# Altium project DigitalInterface_FM.PrjPcb
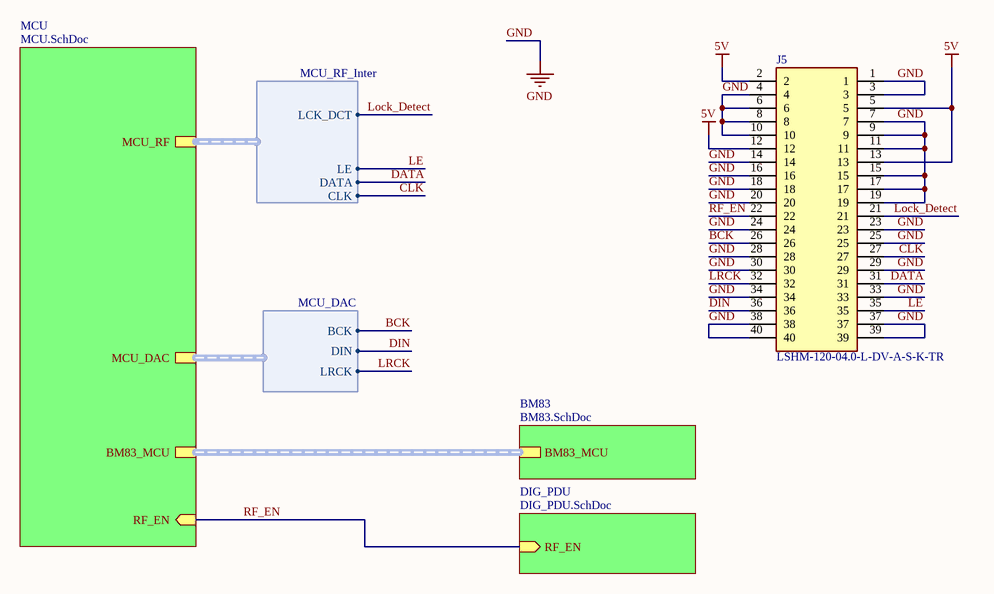
[diagram p0: ConnectorInterface.SchDoc]
4 sheets, 43 parts. Net scope: hierarchical (ports join the sheet entries above them; power ports are global).
Board file: DI_FM.PcbDoc
Sheets:
  ConnectorInterface.SchDoc
    DIG_PDU = DIG_PDU.SchDoc
    MCU = MCU.SchDoc
    BM83 = BM83.SchDoc

## Sheet ConnectorInterface.SchDoc
size 215 x 279 mm; SheetNumber: 1; SheetTotal: 4

### Parts
J5  LSHM-120-04.0-L-DV-A-S-K-TR  [LSHM-120-XX.X-YYY-DV-A-S-K-TR]

### Sub-sheets
BM83 = BM83.SchDoc: BM83_MCU (harness BM83_MCU)
DIG_PDU = DIG_PDU.SchDoc: RF_EN (in)
MCU = MCU.SchDoc: BM83_MCU (harness BM83_MCU), MCU_RF (harness MCU_RF_Inter), MCU_DAC (harness MCU_DAC), RF_EN (in)

### Harnesses
MCU_RF_Inter: LCK_DCT, LE, DATA, CLK
MCU_DAC: BCK, DIN, LRCK

### Nets
5V: J5.2 J5.5 J5.12 J5.13
GND: J5.1 J5.3 J5.4 J5.6 J5.7 J5.8 J5.9 J5.10 J5.11 J5.14 J5.15 J5.16 J5.17 J5.18 J5.19 J5.20 J5.23 J5.24 J5.25 J5.28 J5.29 J5.30 J5.33 J5.34 J5.37 J5.38 J5.39 J5.40
BCK: J5.26 ; sheet MCU/MCU_DAC.BCK
CLK: J5.27 ; sheet MCU/MCU_RF.CLK
DATA: J5.31 ; sheet MCU/MCU_RF.DATA
DIN: J5.36 ; sheet MCU/MCU_DAC.DIN
LE: J5.35 ; sheet MCU/MCU_RF.LE
Lock_Detect: J5.21 ; sheet MCU/MCU_RF.LCK_DCT
LRCK: J5.32 ; sheet MCU/MCU_DAC.LRCK
RF_EN: J5.22 ; sheet DIG_PDU/RF_EN, sheet MCU/RF_EN

### Buses and harness runs
harness sheet BM83/BM83_MCU = sheet MCU/BM83_MCU

### Notes on the sheet
- Contents
- Revision Notes

### Library data of the parts
J5 = LSHM-120-04.0-L-DV-A-S-K-TR: Connector; Manufacturer_Name: SAMTEC; Datasheet Link: http://suddendocs.samtec.com/prints/lshm-1xx-xx.x-xxx-dv-a-x-x-xx-mkt.pdf; Manufacturer_Part_Number: LSHM-120-04.0-L-DV-A-S-K-TR; Mouser Part Number: 200-LSHM12004LDVASK; Mouser Price/Stock: https://www.mouser.co.uk/ProductDetail/Samtec/LSHM-120-040-L-DV-A-S-K-TR?qs=PB6%2FjmICvI1v5WBlLc04lg%3D%3D; Arrow Part Number: LSHM-120-04.0-L-DV-A-S-K-TR; Arrow Price/Stock: https://www.arrow.com/en/products/lshm-120-04.0-l-dv-a-sktr/samtec?region=nac

## Sheet DIG_PDU.SchDoc
size 279 x 215 mm; SheetNumber: 4; SheetTotal: 4
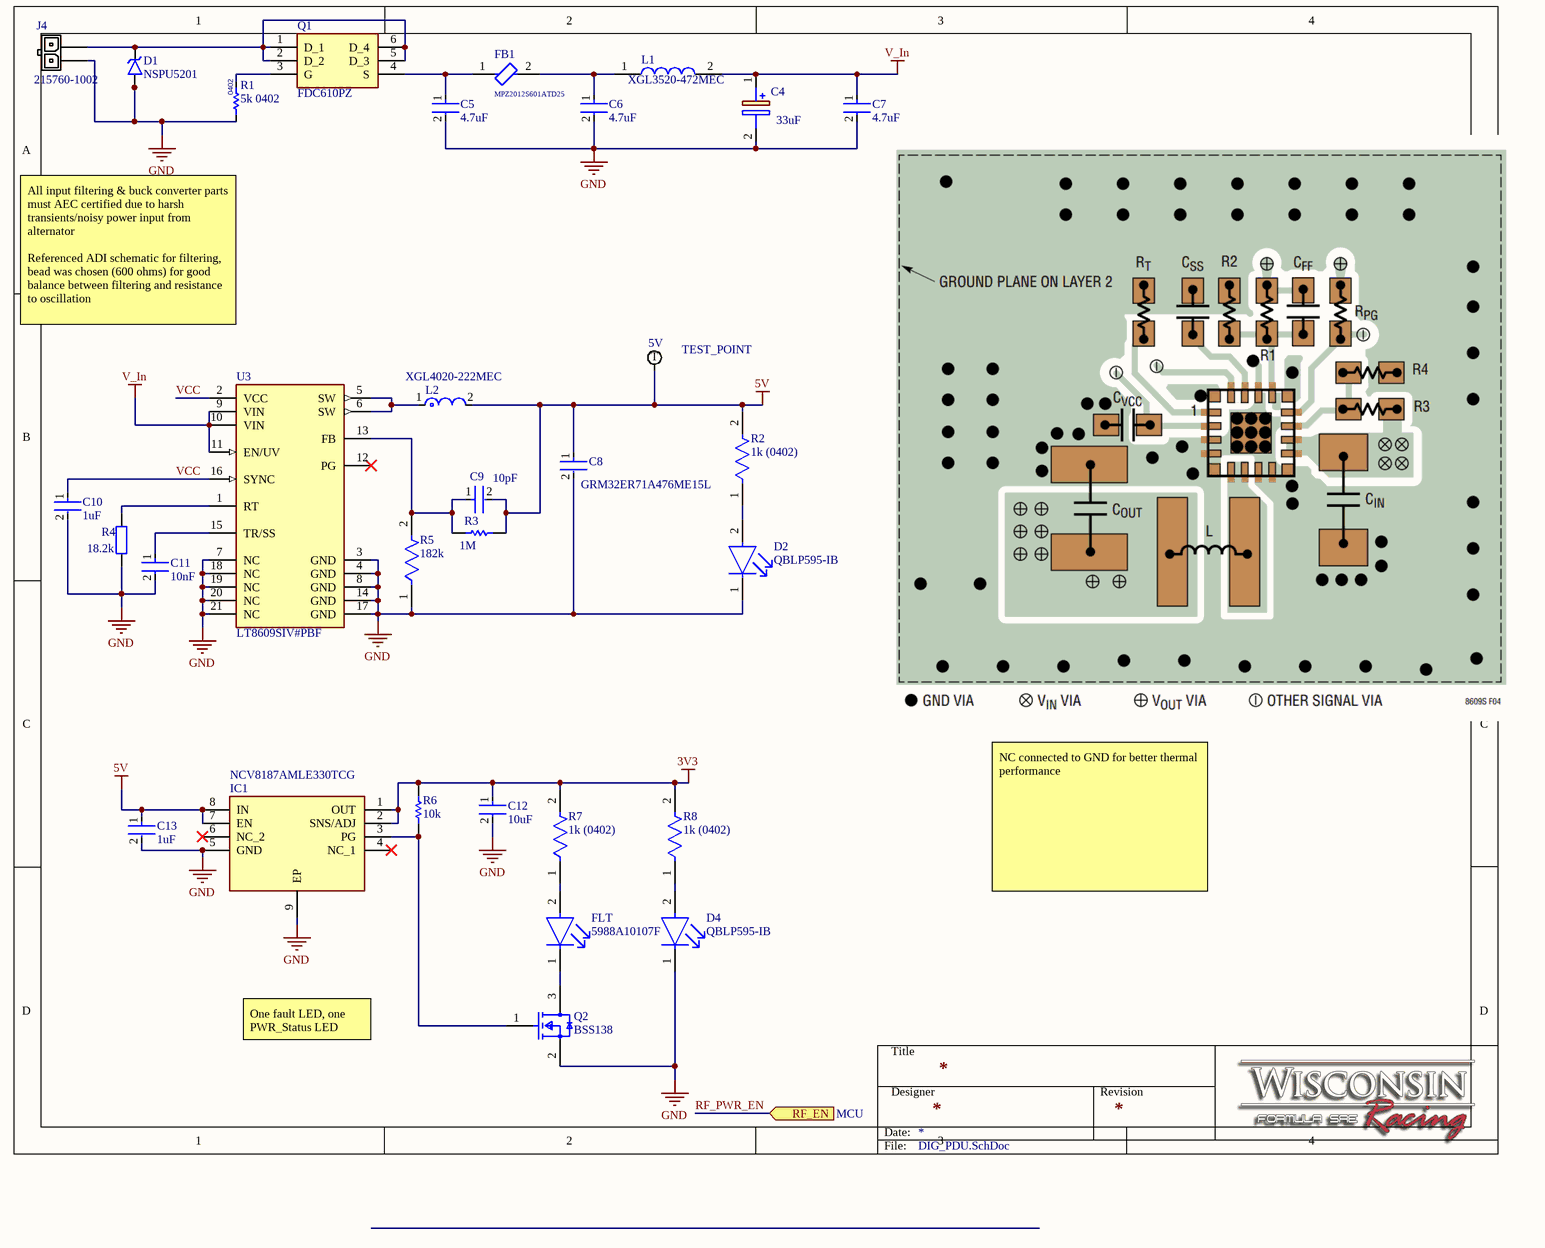
[diagram p1: DIG_PDU.SchDoc]

### Parts
5V  TEST_POINT  [TEST_POINT-Footprint-1]  (no BOM)
C4  HHXC500ARA330MF80G  [CAPAE660X800N]  (value not drawn)
C5  4.7uF  [FP-CGA4J-IPC_C]
C6  4.7uF  [FP-CGA4J-IPC_C]
C7  4.7uF  [FP-CGA4J-IPC_C]
C8  GRM32ER71A476ME15L  [FP-GRM32E-0_3-0_2-IPC_A]
C9  10pF  [FP-GCM155-0_05-IPC_C]
C10  1uF  [FP-GRT155-0_1-IPC_A]
C11  10nF  [FP-GCM155-0_05-IPC_C]
C12  10uF  [FP-GRM155-0_2-IPC_A]
C13  1uF  [FP-GRM155-0_1-IPC_C]
D1  NSPU5201  [NSPM5131MUTBG]
D2  QBLP595-IB  [FP-QBLP595-IB-MFG]
D4  QBLP595-IB  [FP-QBLP595-IB-MFG]
FB1  MPZ2012S601ATD25  [BEADC2012X105N]
FLT  5988A10107F  [FP-5988A10107F-MFG]
IC1  NCV8187AMLE330TCG  [SON65P300X300X100-9N-D]
J4  215760-1002  [215760-1002-Footprint-1]
L1  XGL3520-472MEC  [XGL3520472MEC]
L2  XGL4020-222MEC  [FP-XGL4020-MFG]
Q1  FDC610PZ  [SOT95P280X110-6N]
Q2  BSS138  [FP-318-08-IPC_B]
R1  5k 0402  [Res0402-Type-1]
R2  1k (0402)  [FP-RC0402-0_4-IPC_A]
R3  1M  [RESC1005X40X25NL05T10]
R4  18.2k  [WRIS-RSKS_0402]
R5  182k  [FP-AC0402-IPC_C]
R6  10k  [RESC1005X40X25ML05T05]
R7  1k (0402)  [FP-RC0402-0_4-IPC_A]
R8  1k (0402)  [FP-RC0402-0_4-IPC_A]
U3  LT8609SIV#PBF  [FP-LQFN-16-05-08-1516-MFG]

### Ports
RF_EN (in, see MCU)

### Nets
3V3: C12.1 IC1.1(OUT) IC1.2(SNS/ADJ) R6.2 R7.2 R8.2
5V: 5V.1 C8.1 C9.2 C13.1 IC1.7(EN) IC1.8(IN) L2.2 R2.2 R3.2
GND: C4.2(-) C5.2 C6.2 C7.2 C8.2 C10.2 C11.2 C12.2 C13.2 D1.5(GND_(A)_1) D1.6(GND_(A)_2) D1.7(GND_(A)_3) D1.8(GND_(A)_4) D2.1(C) D4.1(C) IC1.5(GND) IC1.9(EP) J4.2 Q2.2(S) R1.1 R4.1 R5.1 U3.3(GND) U3.4(GND) U3.7(NC) U3.8(GND) U3.14(GND) U3.17(GND) U3.18(NC) U3.19(NC) U3.20(NC) U3.21(NC)
V_In: C4.1(+) C7.1 L1.2 U3.9(VIN) U3.10(VIN) U3.11(EN/UV)
VCC: C10.1 U3.2(VCC) U3.16(SYNC)
NetC5_1: C5.1 FB1.1 Q1.4(S)
NetC6_1: C6.1 FB1.2 L1.1
NetC9_1: C9.1 R3.1 R5.2 U3.13(FB)
NetC11_1: C11.1 U3.15(TR/SS)
NetD1_1: D1.1 D1.2 J4.1 Q1.1(D_1) Q1.2(D_2) Q1.5(D_3) Q1.6(D_4)
NetD2_2: D2.2(A) R2.1
NetD4_2: D4.2(A) R8.1
NetFLT_1: FLT.1(C) Q2.3(D)
NetFLT_2: FLT.2(A) R7.1
NetIC1_3: IC1.3(PG) Q2.1(G) R6.1
NetL2_1: L2.1 U3.5(SW) U3.6(SW)
NetQ1_3: Q1.3(G) R1.2
NetR4_2: R4.2 U3.1(RT)

Not connected (* = marked no-connect by the designer): IC1 4(NC_1)* 6(NC_2)*; U3 12(PG)*

### Notes on the sheet
- (near C4) 33uF
- All input filtering & buck converter parts must AEC certified due to harsh transients/noisy power input from alternator
  Referenced ADI schematic for filtering, bead was chosen (600 ohms) for good balance between filtering and resistance to oscillation
- NC connected to GND for better thermal performance
- One fault LED, one PWR_Status LED
- Title
- Designer
- Revision
- Date:
- File:
- (in symbol CMP-00005-4) T
- (in symbol CMP-Res-00031-1) 0402

### Library data of the parts
5V = CMP-00005-4: Pad for testing
C4 = HHXC500ARA330MF80G: Capacitor Polarised; Manufacturer_Name: Chemi-Con; Datasheet Link: https://www.digikey.com/en/products/detail/chemi-con/HHXC500ARA330MF80G/6928175; Height: 8mm; Manufacturer_Part_Number: HHXC500ARA330MF80G; Mouser Part Number: 661-HHXC500A330MF80G; Mouser Price/Stock: https://www.mouser.co.uk/ProductDetail/Chemi-Con/HHXC500ARA330MF80G?qs=u4fy%2FsgLU9MsXjhGLyQcVQ%3D%3D; Arrow Part Number: HHXC500ARA330MF80G; Arrow Price/Stock: null?utm_currency=USD&region=nac
C5-C7 = CMP-08246-000171-1: Cap Ceramic 4.7uF 50V X7R 10% Pad SMD 0805 +125°C Automotive T/R
C8 = CMP-2000-06363-3: Chip Multilayer Ceramic Capacitors for General Purpose, 1210, 47uF, X7R, 15%, 20%, 10V; Voltage Rating (DC): 10V; Lead Free: Lead Free; Capacitance: 47uF; Max Operating Temperature: 125°C; Height: 2.5mm; Min Operating Temperature: -55°C; Length: 3.2mm; Package Quantity: 1; Termination: SMD/SMT; Case Code (Imperial): 1210; Width: 0.098inch; Voltage Rating: 10V; Thickness: 0.106inch; Depth: 2.5mm; REACH SVHC: No SVHC; Packaging: Tape and Reel; Dielectric: X7R; Voltage: 10V; Radiation Hardening: No; Case Code (Metric): 3225; Tolerance: 20%; Case/Package: 1210; Mount: Surface Mount
C9 = CMP-06035-039712-1: Ceramic Capacitor for Automotive 10pF ±5% 50VDC C0G 0402 Paper T/R; Voltage Rating: 50V; Case/Package: 0402; Dielectric: C0G; Package Quantity: 10000; Ratings: AEC-Q200; Max Operating Temperature: 125°C; Width: 0.02inch; REACH SVHC: No SVHC; Mount: Surface Mount; Min Operating Temperature: -55°C; Lead Free: Lead Free; Packaging: Tape and Reel; Capacitance: 10pF; Case Code (Imperial): 0402; Tolerance: 5%; Height: 0.5mm; Thickness: 0.022inch; Length: 0.039inch; Case Code (Metric): 1005; Weight: 0.000212oz; Voltage Rating (DC): 50V; Termination: SMD/SMT
C10 = CMP-06035-047663-1: Multi-Layer Ceramic Capacitor 1uF 25V X6S ±10% 0402 Paper T/R / GRT155C81E105KE13D
C11 = CMP-2008-03723-3: Ceramic Capacitor for Automotive 10nF ±10% 50VDC X7R 0402 Paper T/R / GCM155R71H103KA55D; Voltage Rating (DC): 50V; Min Operating Temperature: -55°C; Radiation Hardening: No; Mount: Surface Mount; Thickness: 0.022inch; Package Quantity: 1; Case Code (Imperial): 0402; Lead Free: Lead Free; Case/Package: 0402; Depth: 0.5mm; Termination: SMD/SMT; Tolerance: 10%; Voltage: 50V; Packaging: Tape and Reel; Width: 0.02inch; REACH SVHC: No SVHC; Height: 0.5mm; Max Operating Temperature: 125°C; Case Code (Metric): 1005; Voltage Rating: 50V; Capacitance: 10nF; Ratings: AEC-Q200; Length: 1mm; Dielectric: X7R
C12 = CMP-06035-061139-1: Chip Multilayer Ceramic Capacitors for General Purpose, 0402, 10uF, X5R, 15%, 20%, 6.3V
C13 = CMP-06035-028020-1: Chip Multilayer Ceramic Capacitors for General Purpose, 0402, 1.0uF, X7R, 15%, 10%, 10V / GRM155Z71A105KE01D
D1 = CMP-004-000061-2: Unidirectional High Voltage ESD and Surge Protection; Provides ESD Protection to IEC6100042 Level 4: +/-30 kV Contact Discharge; Small Package: 1.8 mm x 2.0 mm; These Devices are PbFree; Manufacturer_Name: onsemi; Arrow Part Number: NSPU5201MUTBG; Design Item ID: NSPU5201MUTBG; Source: SamacSys.SchLib; Mouser Price/Stock: https://www.mouser.co.uk/ProductDetail/ON-Semiconductor/NSPU5201MUTBG?qs=byeeYqUIh0OtIrNH4%2Fsnzg%3D%3D; Mouser Part Number: 863-NSPU5201MUTBG; Height: 0mm; Datasheet Link: https://www.onsemi.com/pub/Collateral/NSPU5201-D.PDF; Manufacturer_Part_Number: NSPU5201MUTBG; Arrow Price/Stock: https://www.arrow.com/en/products/nspu5201mutbg/on-semiconductor
D2 D4 = CMP-113271-000002-1: LED BLUE CLEAR 0402 SMD; Lens Size: 0.5mm; Dominant Wavelength: 465nm; Forward Voltage: 3.1V; Lens Color: Colorless; Luminous Intensity: 85mcd; Test Current: 20mA; Viewing Angle: 140°; Lens Style: Flat; Width: 0.5mm; Case Code (Metric): 1005; Lens Transparency: Clear; Color: Blue; Packaging: Tape and Reel; Case Code (Imperial): 0402; Mount: Surface Mount; Length: 1mm; Case/Package: 0402; Height: 0.6mm
FB1 = CMP-002-000016-2: Ferrite Beads Multi-Layer Power 600Ohm 25% 100MHz 2A 100mOhm DCR 0805 Automotive T/R; Manufacturer_Name: TDK; Arrow Part Number: MPZ2012S601ATD25; Datasheet Link: https://product.tdk.com/system/files/dam/doc/product/emc/emc/beads/catalog/beads_automotive_power_mpz2012_en.pdf; Manufacturer_Part_Number: MPZ2012S601ATD25; Design Item ID: MPZ2012S601ATD25; Height: 1.05mm; Mouser Price/Stock: https://www.mouser.co.uk/ProductDetail/TDK/MPZ2012S601ATD25?qs=n0%2F4YYxsltT7vo9AjVUU7w%3D%3D; Mouser Part Number: 810-MPZ2012S601ATD25; Source: SamacSys.SchLib; Arrow Price/Stock: https://www.arrow.com/en/products/mpz2012s601atd25/tdk.html?utm_currency=USD&region=europe
FLT = CMP-00106-100993512-1: 5988A10107F LED Uni-Color Red 2-Pin Chip 0402(1006Metric) T/R; Forward Voltage: 1.6V; Forward Current: 5mA; Power Dissipation: 46mW; Reverse Voltage: 5V; Luminous Intensity: 65mcd; Viewing Angle: 140°; Wavelength: 635nm; Max Operating Temperature: 85°C; Case/Package: 0402; Color: Red; Height: 533.4µm; NexarPartId: 100993512; RoHS: Compliant; Schedule B: 8541402000, 8541402000; Min Operating Temperature: -40°C
IC1 = NCV8187AMLE330TCG: Integrated Circuit; Manufacturer_Name: onsemi; Datasheet Link: https://www.onsemi.com/pub/Collateral/NCV8187-D.PDF; Height: 1mm; Manufacturer_Part_Number: NCV8187AMLE330TCG; Mouser Part Number: 863-CV8187AMLE330TCG; Mouser Price/Stock: https://www.mouser.co.uk/ProductDetail/onsemi/NCV8187AMLE330TCG?qs=HBWAp0VN4RhK8HbhfCLXcQ%3D%3D; Arrow Part Number: NCV8187AMLE330TCG; Arrow Price/Stock: https://www.arrow.com/en/products/ncv8187amle330tcg/on-semiconductor?region=nac
J4 = CMP-007-000050-6: Micro-Fit+ Right-Angle Header, 3.00mm Pitch, Single Row, 2 Circuits, Matte Tin (Sn) Plating, UL 94V-0, Glow-Wire Capable, Black; Manufacturer 1: Molex; Number of Contacts: 2; Manufacturer Part Number 1: 215760-1002; Number of Rows: 1
L1 = XGL3520-472MEC: Inductor; Manufacturer_Name: COILCRAFT; Datasheet Link: https://www.coilcraft.com/getmedia/d18b8771-c466-42ab-98b9-5b7a3721ea57/xgl3520.pdf?srsltid=AfmBOoq9-uDh3EmdFKVY7cd9_AL22AmMmwAAQ9UBadXdflM2b3sgRKIR; Height: 2mm; Manufacturer_Part_Number: XGL3520-472MEC
L2 = CMP-11268-000045-2: Shielded Power Inductors
Q1 = FDC610PZ: MOSFET (P-Channel); Manufacturer_Name: onsemi; Datasheet Link: https://www.onsemi.com/pub/Collateral/FDC610PZ-D.PDF; Height: 1.1mm; Manufacturer_Part_Number: FDC610PZ; Mouser Part Number: 512-FDC610PZ; Mouser Price/Stock: https://www.mouser.co.uk/ProductDetail/onsemi-Fairchild/FDC610PZ?qs=6olcXJbp99R1vIAdhgXLVw%3D%3D; Arrow Part Number: FDC610PZ; Arrow Price/Stock: https://www.arrow.com/en/products/fdc610pz/on-semiconductor
Q2 = CMP-07173-000101-1: MOSFET N-CH 50V 220MA SOT-23; Turn-Off Delay Time: 20ns; Element Configuration: Single; Rds On Max: 3.5R; Gate to Source Voltage (Vgs): 20V; Threshold Voltage: 1.3V; Number of Elements: 1; Power Dissipation: 360mW; Rise Time: 9ns; Turn-On Delay Time: 2.5ns; Input Capacitance: 27pF; On-State Resistance: 6R; Lead Free: Lead Free; Length: 2.92mm; Width: 1.3mm; Drain to Source Breakdown Voltage: 50V; Min Operating Temperature: -55°C; REACH SVHC: No SVHC; Packaging: Tape and Reel; Radiation Hardening: No; Height: 0.93mm; Drain to Source Voltage (Vdss): 50V; Current Rating: 220mA; Voltage Rating (DC): 50V; Weight: 0.03g; Continuous Drain Current (ID): 220mA; Number of Pins: 3; Nominal Vgs: 1.3V; Max Power Dissipation: 360mW; Fall Time: 9ns; Drain to Source Resistance: 3.5R; Contact Plating: Tin; Case/Package: SOT-23; Package Quantity: 1; Dual Supply Voltage: 50V; Mount: Surface Mount; Termination: SMD/SMT; Max Operating Temperature: 150°C
R1 = CMP-Res-00031-1: Fixed Resistor, Metal Glaze/thick Film, 0.0625W, 5000ohm, 50V, 1% +/-Tol, 100ppm/Cel, Surface Mount, 0402; Power: 63mW; Resistance: 5k; Tolerance: 1%
R2 R7 R8 = CMP-2002-07472-3: RES 1K OHM 1% 1/16W 0402; Max Power Dissipation: 63mW; Resistance: 1kR; Voltage Rating (DC): 50V; Temperature Coefficient: 100ppm/°C; Power Rating: 62.5mW; Technology: THICK FILM; Size Code: 0402; Series: RC; Length: 1mm; Case/Package: 0402; Features: Moisture Resistant; Termination: SMD/SMT; Case Code (Metric): 1005; Reach SVHC Compliant: Yes; Number of Terminations: 2; Tolerance: 1%; Lead Free: Lead Free; Military Standard: Not; Resistor Type: Thick Film; Max Operating Temperature: 155°C; RoHS Compliant: Yes; Construction: Rectangular; Voltage Rating: 50V; Packaging: Tape and Reel; Height: 0.32mm; Number of Pins: 2; Resistance Tolerance: 1%; Case Code (Imperial): 0402; Depth: 0.5mm; Min Operating Temperature: -55°C; Width: 0.5mm
R3 = CMP-2002-07490-1: Manufacturer: Yageo / Phycomp; Part Number: RC0402FR-071ML
R4 = CMP-03913-145532814-2: Resistor, 18K2, 0.1W, Thick Film, 0402 Rohs Compliant: Yes; Manufacturer Lifecycle Status: ACTIVE; YEOL: 1 = Estimated lifetime > 10 years; Resistance: 18.2kΩ; Min Operating Temperature: -55°C; Height: 350µm; RoHS: Compliant; Lifecycle Status: Production; Width: 500µm; Length: 1mm; Max Operating Temperature: 155°C
R5 = CMP-03412-035751-2: RES 182kΩ ±1% 0.063W 0402; Max Power Dissipation: 63mW; Resistance: 182kR; Power Rating: 62.5mW; Temperature Coefficient: 100ppm/°C; Voltage Rating: 50V; Number of Terminations: 2; Tolerance: 1%; Case/Package: 0402; Min Operating Temperature: -55°C; Length: 0.039inch; Packaging: Tape and Reel; Case Code (Metric): 1005; Termination: SMD/SMT; Width: 0.5mm; RoHS Compliant: Yes; Resistor Type: Thick Film; Height: 0.015inch; Max Operating Temperature: 155°C; Series: AC; Case Code (Imperial): 0402; Weight: 2.3E-05oz; Features: Moisture Resistant
R6 = CMP-2002-00433-1: Part Number: ERJ-2GEJ103X; Manufacturer: Panasonic
U3 = CMP-09139-000009-1: IC REG BUCK ADJUSTABLE 2A 16LQFN; Manufacturer: Analog Devices; Standoff Height: 0.01mm; Nominal Supply Current: 1-1.7uA; Min Supply Voltage: 3V; Max Duty Cycle: 100%; Output Type: AdjustableProgrammable; Max Junction Temp: +125°C; Switching Frequency: 200-2200kHz; Max Supply Voltage: 42V; Number Of Outputs: 1; Digikey Description: IC REG BUCK ADJUSTABLE 2A 16LQFN; Octopart: https://octopart.com/lt8609siv%23pbf-analog+devices-88316701; Automotive: No; Package: LQFN-16-05-08-1516; Temperature Range High: +125°C; Category: IC; Temperature Range Low: -40°C; ComponentLink2Description: Datasheet; Output Current: 2A; Mouser Description: LT8609S - 42V, 2A/3A Peak Synchronous Step-Down Regulator with 2.5µA Quiescent Current; Temperature: -40°C to +125°C; ComponentLink2URL: https://www.analog.com/media/en/technical-documentation/data-sheets/LT8609S.pdf; RoHS: TRUE; Device Class L2: Power Management ICs; Device Class L3: Voltage Regulators - Switching; Height: 1.03mm; Device Class L1: Integrated Circuits (ICs); Switching Topology: Buck; Lead Free: Yes; Manufacturer Part Number: LT8609SIV#PBF

## Sheet MCU.SchDoc
size 279 x 215 mm; SheetNumber: 3; SheetTotal: 4; SPICEModelCacheLZXJEGGY: <root> / <DocumentId>LZXJEGGY</DocumentId> / <CacheFrame Number="0"> / <Model Name="cap" Kind="MDL"> / <Text>*Default semiconductor capacitor / .MODEL CAP C()</Text> / </Model> / </CacheFrame> / </root>
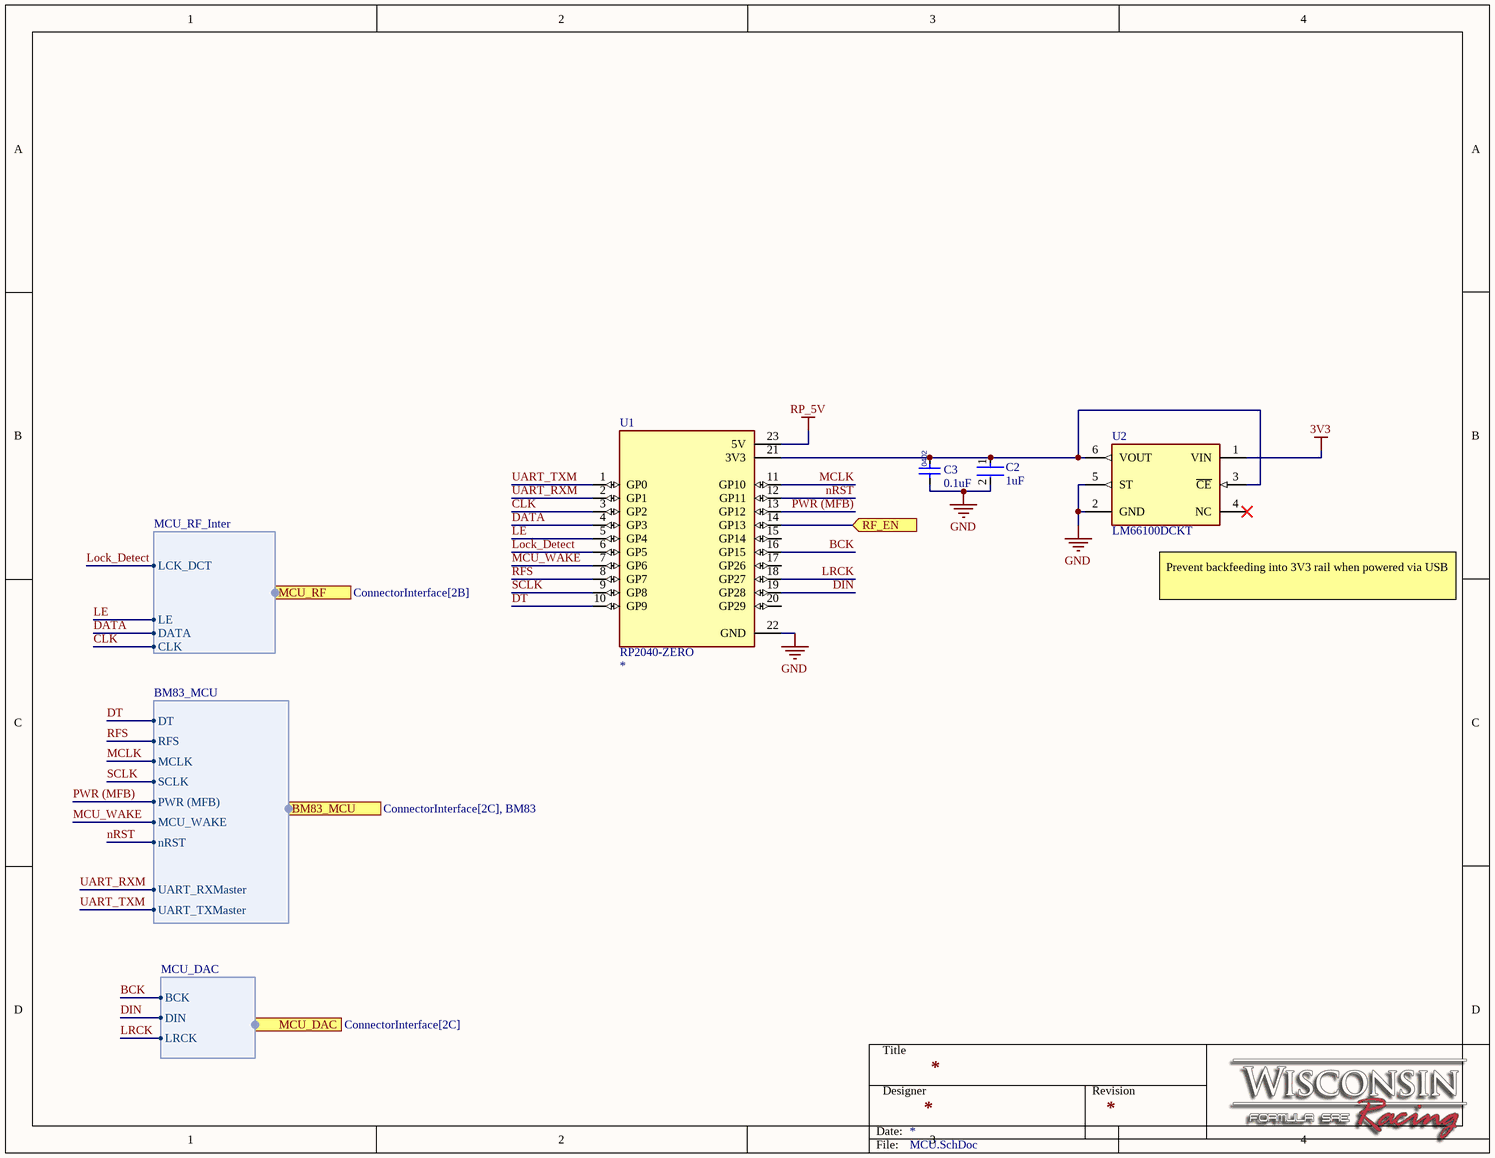
[diagram p2: MCU.SchDoc]

### Parts
C2  1uF  [FP-GRM155-0_1-IPC_C]
C3  0.1uF  [FP-CC0402-IPC_B]
U1  RP2040-ZERO  [MODULE_RP2040-ZERO]
U2  LM66100DCKT  [FP-DCK0006A-IPC_C]

### Ports
BM83_MCU (harness BM83_MCU, see ConnectorInterface[2C], BM83), MCU_DAC (harness MCU_DAC, see ConnectorInterface[2C]), MCU_RF (harness MCU_RF_Inter, see ConnectorInterface[2B]), RF_EN (in, see ConnectorInterface[2C], DIG_PDU)

### Harnesses
BM83_MCU: MCLK, MCU_WAKE, SCLK, PWR (MFB), RFS, DT, nRST, UART_TXMaster, UART_RXMaster
MCU_RF_Inter: LCK_DCT, LE, DATA, CLK
MCU_DAC: BCK, DIN, LRCK

### Nets
3V3: U2.1(VIN)
GND: C2.2 C3.1 U1.22(GND) U2.2(GND) U2.5(ST)
RP_5V: U1.23(5V)
BCK: U1.16(GP15) ; port MCU_DAC.BCK
CLK: U1.3(GP2) ; port MCU_RF.CLK
DATA: U1.4(GP3) ; port MCU_RF.DATA
DIN: U1.19(GP28) ; port MCU_DAC.DIN
DT: U1.10(GP9) ; port BM83_MCU.DT
LE: U1.5(GP4) ; port MCU_RF.LE
Lock_Detect: U1.6(GP5) ; port MCU_RF.LCK_DCT
LRCK: U1.18(GP27) ; port MCU_DAC.LRCK
MCLK: U1.11(GP10) ; port BM83_MCU.MCLK
MCU_WAKE: U1.7(GP6) ; port BM83_MCU.MCU_WAKE
nRST: U1.12(GP11) ; port BM83_MCU.nRST
PWR (MFB): U1.13(GP12) ; port BM83_MCU.PWR (MFB)
RF_EN: U1.14(GP13) ; port RF_EN
RFS: U1.8(GP7) ; port BM83_MCU.RFS
SCLK: U1.9(GP8) ; port BM83_MCU.SCLK
UART_RXM: U1.2(GP1) ; port BM83_MCU.UART_RXMaster
UART_TXM: U1.1(GP0) ; port BM83_MCU.UART_TXMaster
NetC2_1: C2.1 C3.2 U1.21(3V3) U2.3(~{CE}) U2.6(VOUT)

Not connected (* = marked no-connect by the designer): U1 15(GP14) 17(GP26) 20(GP29); U2 4(NC)*

### Notes on the sheet
- (near U2) Prevent backfeeding into 3V3 rail when powered via USB
- Title
- Designer
- Revision
- Date:
- File:
- (in symbol CMP-Cap-00006-1) 0402

### Library data of the parts
C2 = CMP-06035-028020-1: as C13 on sheet DIG_PDU
C3 = CMP-Cap-00006-1: Ceramic Capacitor, Multilayer, Ceramic, 16V, 10% +Tol, 10% -Tol, X7R, 15% TC, 0.1uF, Surface Mount, 0402; Dielectric: XR7; Capacitance: 100nF; Tolerance: 10%; Voltage Rating: 16V
U1 = CMP-202-000000-5: Low-Cost, High-Performance Pico-Like MCU Board Based On Raspberry Pi Microcontroller RP2040; MF: Waveshare Electronics; MP: RP2040-ZERO; Component Type: Standard; Value: *; Source: RP2040-ZERO.SchLib; Pin Count: 23; Check_prices: https://www.snapeda.com/parts/RP2040-ZERO/Waveshare+Electronics/view-part/?ref=eda; SnapEDA_Link: https://www.snapeda.com/parts/RP2040-ZERO/Waveshare+Electronics/view-part/?ref=snap; Package: Package; Design Item ID: RP2040-ZERO
U2 = CMP-04910-000059-1: IC OR CTRLR IDEAL DIODE SC70-6

## Sheet BM83.SchDoc
size 279 x 215 mm; SheetNumber: 1; SheetTotal: 4; SPICEModelCacheLVVEWYVA: <root> / <DocumentId>LVVEWYVA</DocumentId> / <CacheFrame Number="0"> / <Model Name="cap" Kind="MDL"> / <Text>*Default semiconductor capacitor / .MODEL CAP C()</Text> / </Model> / </CacheFrame> / </root>
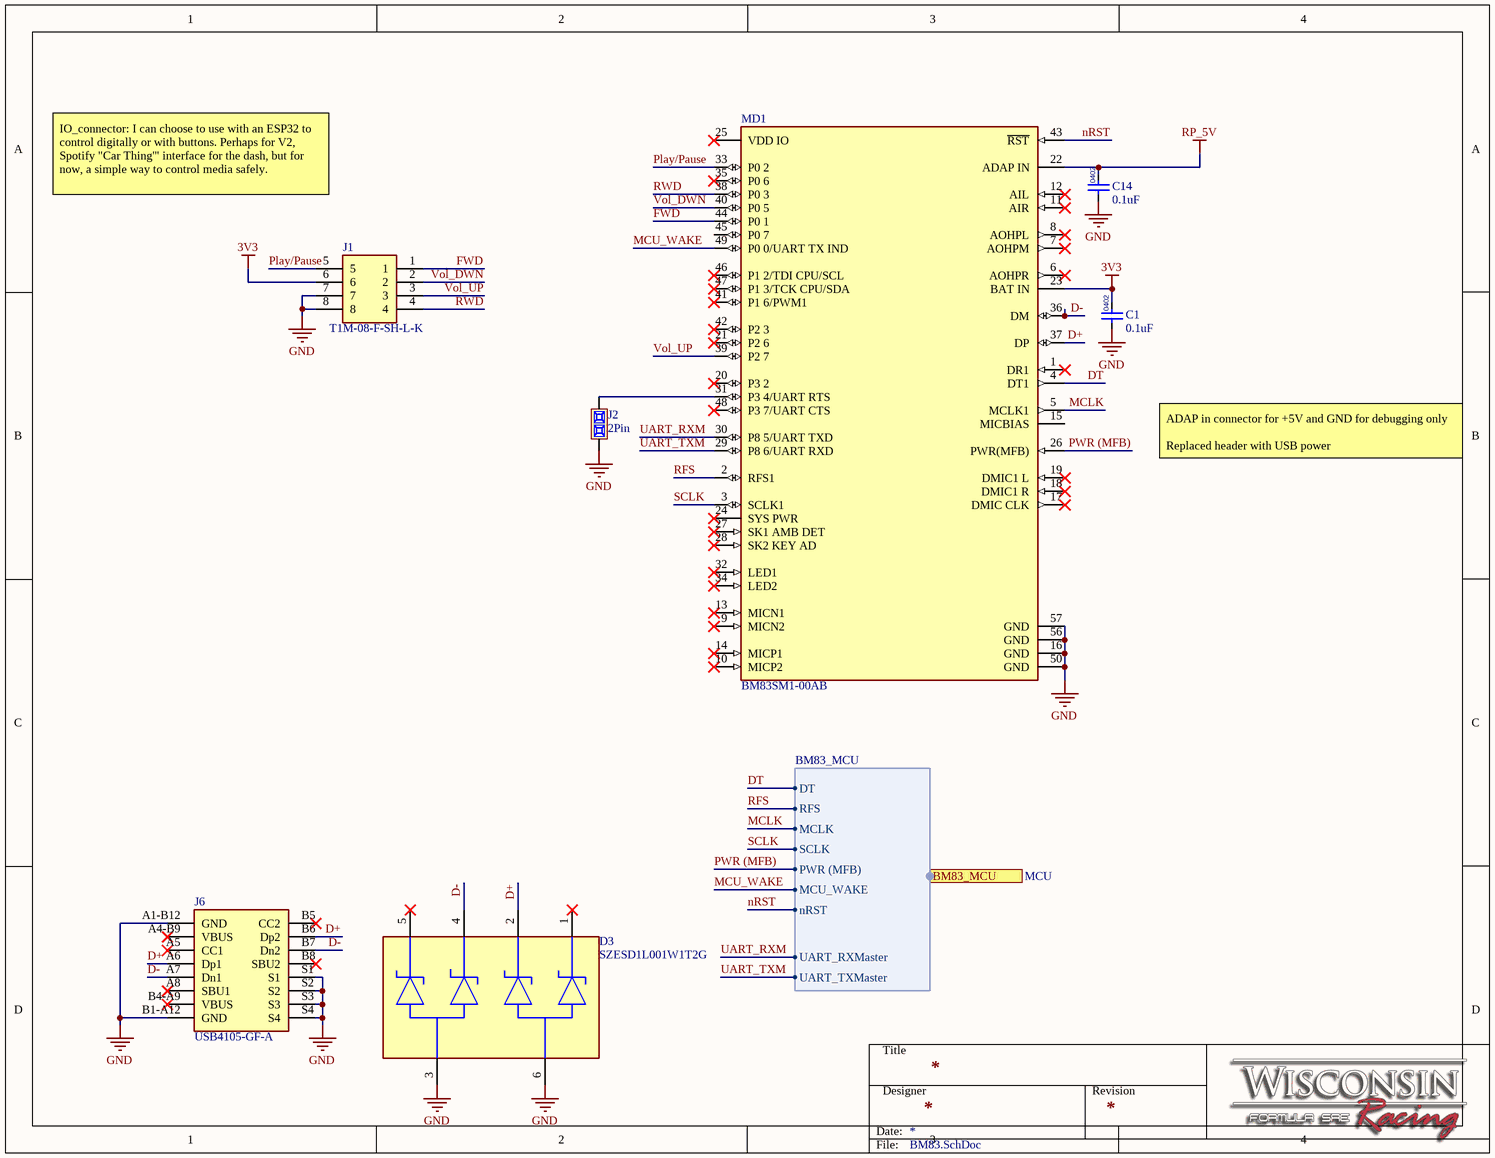
[diagram p3: BM83.SchDoc]

### Parts
C1  0.1uF  [FP-CC0402-IPC_B]
C14  0.1uF  [FP-CC0402-IPC_B]
D3  SZESD1L001W1T2G  [FP-419B-02-MFG]
J1  T1M-08-F-SH-L-K  [T1M-08-F-SH-L-K]
J2  2Pin  [2 Pin Male]
J6  USB4105-GF-A  [USB4105-GF-A]
MD1  BM83SM1-00AB  [FP-BM83SM1-00AB-MFG]

### Ports
BM83_MCU (harness BM83_MCU, see MCU)

### Harnesses
BM83_MCU: MCLK, MCU_WAKE, SCLK, PWR (MFB), RFS, DT, nRST, UART_TXMaster, UART_RXMaster

### Nets
3V3: C1.2 J1.6 MD1.23(BAT_IN)
GND: C1.1 C14.1 D3.3(GND) D3.6(GND) J1.7 J1.8 J2.1 J6.A1-B12(GND) J6.B1-A12(GND) J6.S1 J6.S2 J6.S3 J6.S4 MD1.16(GND) MD1.50(GND) MD1.56(GND) MD1.57(GND)
RP_5V: C14.2 MD1.22(ADAP_IN)
D+: D3.2(2_CATHODE) J6.A6(Dp1) J6.B6(Dp2) MD1.37(DP)
D-: D3.4(3_CATHODE) J6.A7(Dn1) J6.B7(Dn2) MD1.36(DM)
DT: MD1.4(DT1) ; port BM83_MCU.DT
FWD: J1.1 MD1.44(P0_1)
MCLK: MD1.5(MCLK1) ; port BM83_MCU.MCLK
MCU_WAKE: MD1.49(P0_0/UART_TX_IND) ; port BM83_MCU.MCU_WAKE
nRST: MD1.43(~{RST}) ; port BM83_MCU.nRST
Play/Pause: J1.5 MD1.33(P0_2)
PWR (MFB): MD1.26(PWR(MFB)) ; port BM83_MCU.PWR (MFB)
RFS: MD1.2(RFS1) ; port BM83_MCU.RFS
RWD: J1.4 MD1.38(P0_3)
SCLK: MD1.3(SCLK1) ; port BM83_MCU.SCLK
UART_RXM: MD1.30(P8_5/UART_TXD) ; port BM83_MCU.UART_RXMaster
UART_TXM: MD1.29(P8_6/UART_RXD) ; port BM83_MCU.UART_TXMaster
Vol_DWN: J1.2 MD1.40(P0_5)
Vol_UP: J1.3 MD1.39(P2_7)
NetJ2_2: J2.2 MD1.31(P3_4/UART_RTS)

Not connected (* = marked no-connect by the designer): D3 1(1_CATHODE)* 5(4_CATHODE)*; J6 A4-B9(VBUS)* A5(CC1)* A8(SBU1)* B4-A9(VBUS)* B5(CC2)* B8(SBU2)*; MD1 1(DR1)* 6(AOHPR)* 7(AOHPM)* 8(AOHPL)* 9(MICN2)* 10(MICP2)* 11(AIR)* 12(AIL)* 13(MICN1)* 14(MICP1)* 15(MICBIAS) 17(DMIC_CLK)* 18(DMIC1_R)* 19(DMIC1_L)* 20(P3_2)* 21(P2_6)* 24(SYS_PWR)* 25(VDD_IO)* 27(SK1_AMB_DET)* 28(SK2_KEY_AD)* 32(LED1)* 34(LED2)* 35(P0_6)* 41(P1_6/PWM1)* 42(P2_3)* 45(P0_7) 46(P1_2/TDI_CPU/SCL)* 47(P1_3/TCK_CPU/SDA)* 48(P3_7/UART_CTS)*

### Notes on the sheet
- IO_connector: I can choose to use with an ESP32 to control digitally or with buttons. Perhaps for V2, Spotify "Car Thing'" interface for the dash, but for now, a simple way to control media safely.
- ADAP in connector for +5V and GND for debugging only
  Replaced header with USB power
- Title
- Designer
- Revision
- Date:
- File:
- (in symbol CMP-Cap-00006-1) 0402

### Library data of the parts
C1 C14 = CMP-Cap-00006-1: as C3 on sheet MCU; Tolerance: 10%; Voltage Rating: 16V
D3 = CMP-00278-82193701-1: SZESD1L001W1T2G ESD Protection Diode for High Speed Data Line Low Capacitance 4-Channel 6-Pin SC-88 T/R; Manufacturer Lifecycle Status: ACTIVE; Peak Pulse Current: 30A; Reverse Standoff Voltage: 5V; Direction: Unidirectional; Number of Channels: 4; Max Junction Temperature (Tj): 125°C; Breakdown Voltage: 16.5V; Capacitance: 200fF; RoHS: Compliant; Min Operating Temperature: -55°C; NexarPartId: 82193701; Packaging: Cut Tape; Max Operating Temperature: 125°C; Lifecycle Status: Production; Height: 1.1mm
J1 = T1M-08-F-SH-L-K: Connector; Manufacturer_Name: SAMTEC; Datasheet Link: https://suddendocs.samtec.com/prints/t1m-xx-x-sh-l-x-xx-mkt.pdf?_gl=1*uq43fd*_gcl_au*ODYxNDQ2NDA1LjE3NjEzMDczOTg.*_ga*MTA1NTI3NDYyNy4xNjk0MTg3NDQy*_ga_3KFNZC07WW*czE3NjEzMDczOTckbzEzOCRnMSR0MTc2MTMwNzkyNyRqNTUkbDAkaDA.; Height: 4.6mm; Manufacturer_Part_Number: T1M-08-F-SH-L-K; Mouser Part Number: 200-T1M08FSHLK; Mouser Price/Stock: https://www.mouser.co.uk/ProductDetail/Samtec/T1M-08-F-SH-L-K?qs=PB6%2FjmICvI34CkCBlJWkQg%3D%3D
J2 = CMP-007-000048-3: Board Connector, 2 Contact(s), 1 Row(s), Male, Straight, 0.1 inch Pitch, Solder Terminal, Black Insulator, Receptacle; MIL Conformance: No; Contact Pattern: RECTANGULAR; Body Breadth: 0.092inch; Dielectric Withstanding Voltage (AC): 750V; Plating Thickness: 100uin; Reliability: COMMERCIAL; Option: General Purpose; Body Depth: 0.09inch; Number of Contacts: 2; Reference Standard: UL; Number Of PCB Rows: 1; Contact Style: SQ PIN-SKT; Mating Information: MULTIPLE MATING PARTS AVAILABLE; Body Length: 0.184inch; Rated Current (Signal): 3A; Insulation Resistance: 5GR; Min Operating Temperature: -65°C; Termination: Solder; Source: Components - 16.09.22 - 20.27.SchLib; RoHS Compliant: No; Filter Feature: No; Insulation Color: Black; Contact Finish - Mating: NOT SPECIFIED; Connector Type: BOARD CONNECTOR; Contact Material: Bronze; Design Item ID: CMP-002-00006-7; Flammability Rating: UL94 V-0; JESD-609 Code: e0; REACH SVHC: No SVHC; Max Operating Temperature: 105°C; Insulation Material: Thermoplastic; Mixed Contacts: No; Number Of Connectors: 1; Number of Rows Loaded: 1; Mount: Board; Body/Shell Style: RECEPTACLE; IEC Conformance: No; Terminal Pitch: 2.54mm; Mating Contact Pitch: 0.1inch; Terminal Length: 0.12inch; Contact Gender: Male; Contact Finish - Termination: TIN LEAD OVER NICKEL; Mounting Style: STRAIGHT; DIN Conformance: No; PCB Contact Pattern: RECTANGULAR
J6 = CMP-007-000084-3: Conn USB 2.0 Type C RCP 24 POS 0.3mm/0.5mm Solder RA SMD 24 Terminal 1 Port T/R
MD1 = CMP-06331-000058-1: BLUETOOTH AUDIO MODULE

## Nets that join several sheets
3V3: DIG_PDU (6 pins), MCU (U2.1), BM83 (C1.2 J1.6 MD1.23)
5V: ConnectorInterface (J5.2 J5.5 J5.12 J5.13), DIG_PDU (9 pins)
GND: ConnectorInterface (28 pins), DIG_PDU (32 pins), MCU (5 pins), BM83 (17 pins)
RP_5V: MCU (U1.23), BM83 (C14.2 MD1.22)
BCK: ConnectorInterface (J5.26), MCU (U1.16)
CLK: ConnectorInterface (J5.27), MCU (U1.3)
DATA: ConnectorInterface (J5.31), MCU (U1.4)
DIN: ConnectorInterface (J5.36), MCU (U1.19)
DT: MCU (U1.10), BM83 (MD1.4)
LE: ConnectorInterface (J5.35), MCU (U1.5)
Lock_Detect: ConnectorInterface (J5.21), MCU (U1.6)
LRCK: ConnectorInterface (J5.32), MCU (U1.18)
MCLK: MCU (U1.11), BM83 (MD1.5)
MCU_WAKE: MCU (U1.7), BM83 (MD1.49)
nRST: MCU (U1.12), BM83 (MD1.43)
PWR (MFB): MCU (U1.13), BM83 (MD1.26)
RF_EN: ConnectorInterface (J5.22), MCU (U1.14)
RFS: MCU (U1.8), BM83 (MD1.2)
SCLK: MCU (U1.9), BM83 (MD1.3)
UART_RXM: MCU (U1.2), BM83 (MD1.30)
UART_TXM: MCU (U1.1), BM83 (MD1.29)